# EAGLE design project (EAGLE 6.4)
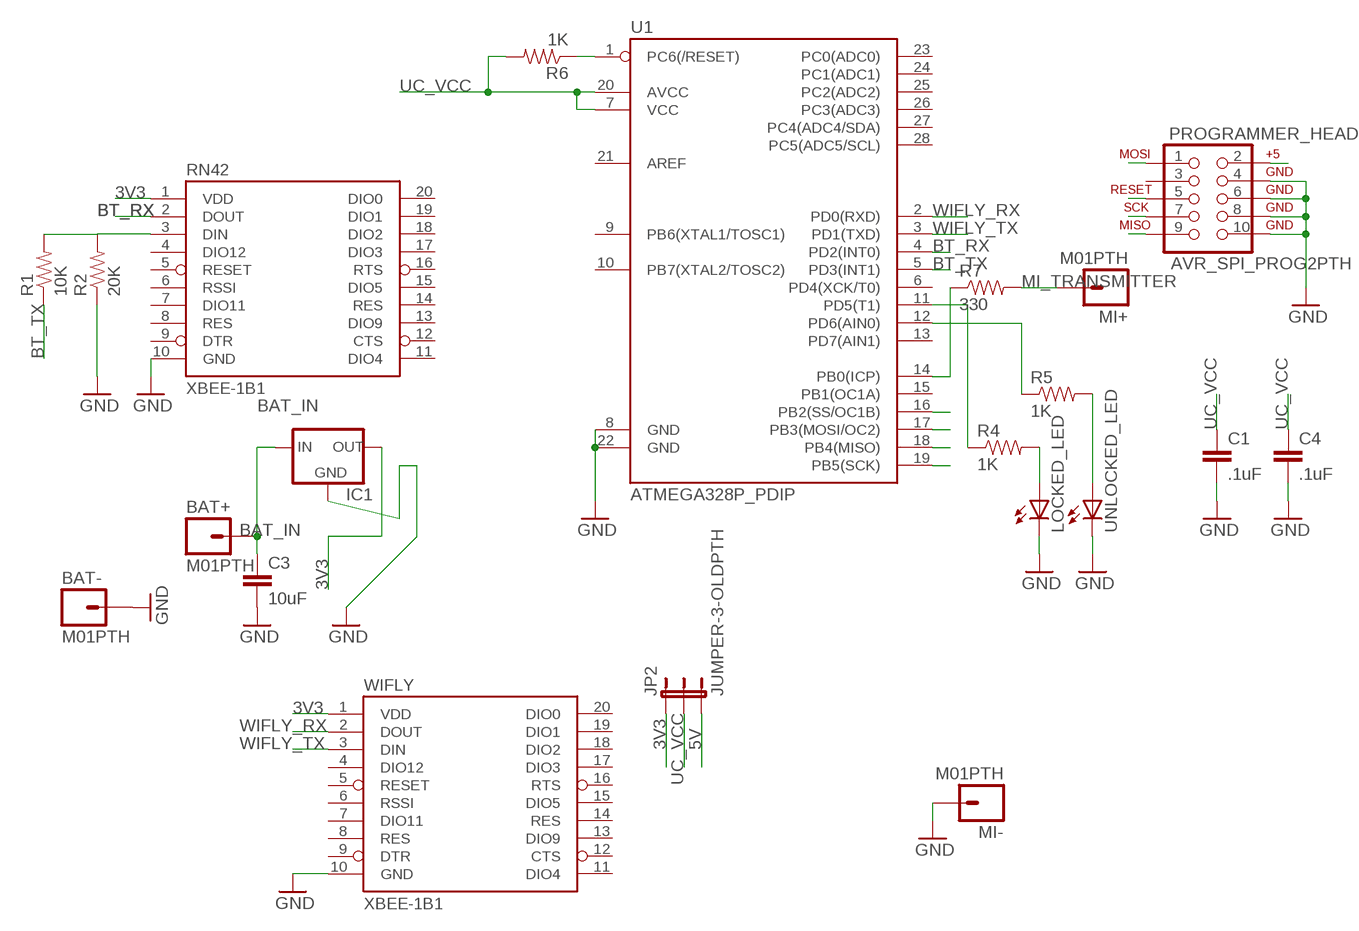
[diagram p0: schematic, sheet 1]

## Parts
BAT+  M01PTH  [1X01]
BAT-  M01PTH  [1X01]
C1  .1uF  CAPPTH  [CAP-PTH-SMALL]
C3  10uF  CAPPTH  [CAP-PTH-SMALL]
C4  .1uF  CAPPTH  [CAP-PTH-SMALL]
IC1  V_REG_78XXSIDE  [78XXL]
JP2  JUMPER-3-OLDPTH  [1X03]
LOCKED_LED  LED5MM  [LED5MM]
MI+  M01PTH  [1X01]
MI-  M01PTH  [1X01]
PROGRAMMER_HEADER  AVR_SPI_PROG2PTH  [AVR_ICSP]
R1  10K  RESISTORAXIAL-0.3  [AXIAL-0.3]
R2  20K  RESISTORAXIAL-0.3  [AXIAL-0.3]
R4  1K  RESISTORAXIAL-0.3  [AXIAL-0.3]
R5  1K  RESISTORAXIAL-0.3  [AXIAL-0.3]
R6  1K  RESISTORAXIAL-0.3  [AXIAL-0.3]
R7  330  RESISTORAXIAL-0.3  [AXIAL-0.3]
RN42  XBEE-1B1  [XBEE-1]
U1  ATMEGA328P_PDIP  [DIL28-3]
UNLOCKED_LED  LED5MM  [LED5MM]
WIFLY  XBEE-1B1  [XBEE-1]

## Nets
3V3: IC1.OUT JP2.1 RN42.1(VDD) WIFLY.1(VDD)
5V: JP2.3 PROGRAMMER_HEADER.2
BAT_IN: BAT+.1 C3.1 IC1.IN
BT_RX: RN42.2(DOUT) U1.4(PD2(INT0))
BT_TX: R1.P$1 U1.5(PD3(INT1))
GND: BAT-.1 C1.2 C3.2 C4.2 IC1.GND LOCKED_LED.K(C) MI-.1 PROGRAMMER_HEADER.4 PROGRAMMER_HEADER.6 PROGRAMMER_HEADER.8 PROGRAMMER_HEADER.10 R2.P$1 RN42.10(GND) U1.8(GND) U1.22(GND) UNLOCKED_LED.K(C) WIFLY.10(GND)
MI_TRANSMITTER: MI+.1 R7.P$2
MISO: PROGRAMMER_HEADER.9 U1.18(PB4(MISO))
MOSI: PROGRAMMER_HEADER.1 U1.17(PB3(MOSI/OC2))
N$1: R1.P$2 R2.P$2 RN42.3(DIN)
N$2: R5.P$1 U1.12(PD6(AIN0))
N$3: U1.16(PB2(SS/OC1B))
N$4: R4.P$1 U1.11(PD5(T1))
N$5: LOCKED_LED.A R4.P$2
N$6: R5.P$2 UNLOCKED_LED.A
N$7: R7.P$1 U1.14(PB0(ICP))
RESET: PROGRAMMER_HEADER.5 R6.P$1 U1.1(PC6(/RESET))
SCK: PROGRAMMER_HEADER.7 U1.19(PB5(SCK))
UC_VCC: C1.1 C4.1 JP2.2 R6.P$2 U1.7(VCC) U1.20(AVCC)
WIFLY_RX: U1.2(PD0(RXD)) WIFLY.2(DOUT)
WIFLY_TX: U1.3(PD1(TXD)) WIFLY.3(DIN)
Unconnected: PROGRAMMER_HEADER.3 RN42.4(DIO12) RN42.5(RESET) RN42.6(RSSI) RN42.7(DIO11) RN42.8(RES) RN42.9(DTR) RN42.11(DIO4) RN42.12(CTS) RN42.13(DIO9) RN42.14(RES) RN42.15(DIO5) RN42.16(RTS) RN42.17(DIO3) RN42.18(DIO2) RN42.19(DIO1) RN42.20(DIO0) U1.6(PD4(XCK/T0)) U1.9(PB6(XTAL1/TOSC1)) U1.10(PB7(XTAL2/TOSC2)) U1.13(PD7(AIN1)) U1.15(PB1(OC1A)) U1.21(AREF) U1.23(PC0(ADC0)) U1.24(PC1(ADC1)) U1.25(PC2(ADC2)) U1.26(PC3(ADC3)) U1.27(PC4(ADC4/SDA)) U1.28(PC5(ADC5/SCL)) WIFLY.4(DIO12) WIFLY.5(RESET) WIFLY.6(RSSI) WIFLY.7(DIO11) WIFLY.8(RES) WIFLY.9(DTR) WIFLY.11(DIO4) WIFLY.12(CTS) WIFLY.13(DIO9) WIFLY.14(RES) WIFLY.15(DIO5) WIFLY.16(RTS) WIFLY.17(DIO3) WIFLY.18(DIO2) WIFLY.19(DIO1) WIFLY.20(DIO0)

## Library data of the parts
BAT+ BAT- MI+ MI- = SparkFun-Connectors:M01: Header 1 Standard 1-pin 0.1" header. Use with straight break away headers (SKU : PRT-00116), right angle break away headers (PRT-00553), swiss pins (PRT-00743), machine pins (PRT-00117), and female headers (PRT-00115).
C1 C3 C4 = SparkFun-Capacitors:CAP: Capacitor Standard 0603 ceramic capacitor, and 0.1" leaded capacitor.
IC1 = SparkFun-PowerIC:V_REG_78XX: Voltage Regulator Standard 7805 5V regulator. IGO (Input Ground Output). Spark Fun Electronics SKU : COM-00107
JP2 = SparkFun-Passives:JUMPER-3-OLD
LOCKED_LED UNLOCKED_LED = SparkFun-LED:LED: LEDs Standard schematic elements and footprints for 5mm, 3mm, 1206, and 0603 sized LEDs. 5mm - Spark Fun Electronics SKU : COM-00529 (and others)
PROGRAMMER_HEADER = SparkFun-Connectors:AVR_SPI_PROG2: AVR 10-pin ICSP Header This is the standard AVR In Circuit Serial Programming header. Minimal, but includes pin one indicator. Works with standard Olimex programmers. Also look for the 6-pin reduced version. Spark Fun Electronics SKU: PRT-00778
R1 R2 R4-R7 = SparkFun-Passives:RESISTOR: Resistor Basic schematic elements and footprints for 0603, 1206, and PTH resistors.
RN42 WIFLY = SparkFun-RF:XBEE-1: Xbee module footprints SMT header is CONN-09042.
U1 = SparkFun-DigitalIC:ATMEGA328P_PDIP: uC used in the Arduino 32kb flash, 1k EEPROM, 2k SRAM This is the through-hole version of this chip.

## Board
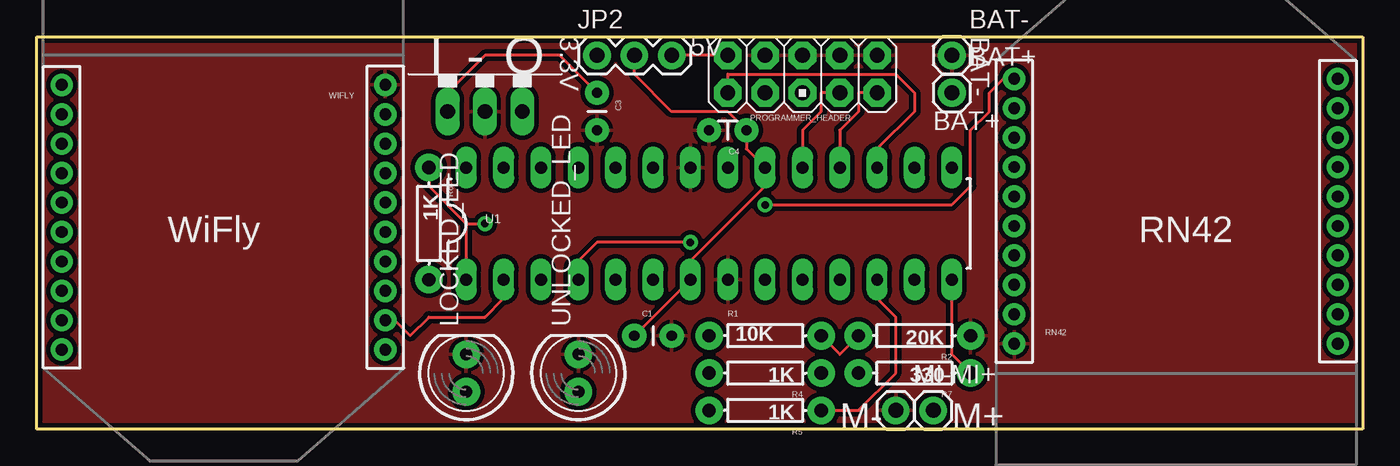
[diagram p1: board, top side]
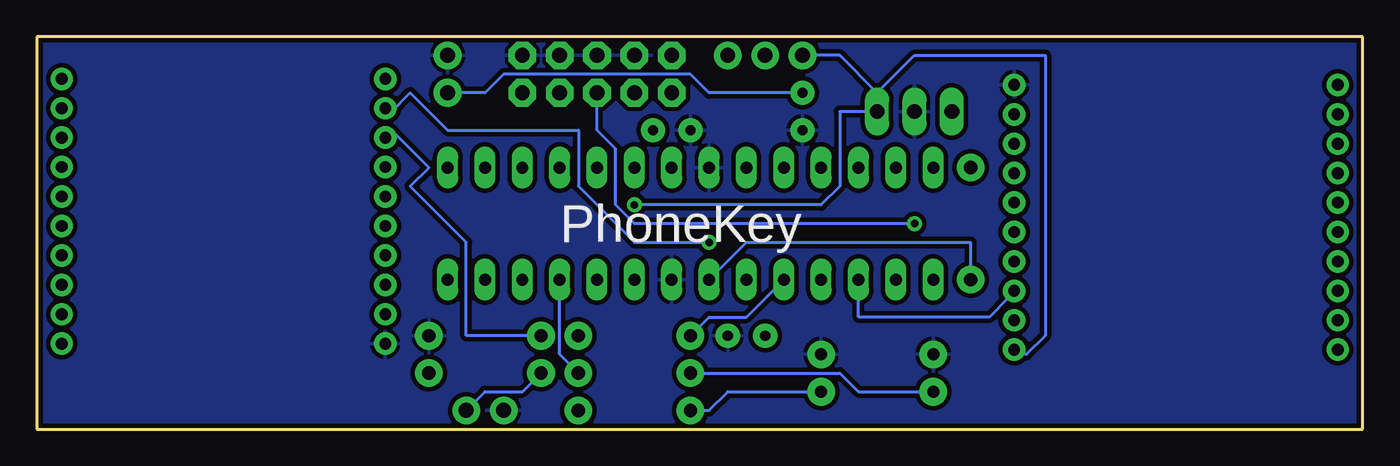
[diagram p2: board, bottom side, seen from below]

Size 90.17 x 26.67 mm. Coordinates in mm from the lower left corner, seen from the top.
Outline: 90.17,26.67 90.17,0 0,0 0,26.67 90.17,26.67
Copper layers (1*16): Top 0.035mm / dielectric 1.5mm / Bottom 0.035mm
Design rules "SparkFun": minimum track width 8mil, minimum drill 20mil, track to track 8mil, track to pad 8mil, pad to pad 8mil, via to via 8mil, smd to smd 8mil, copper to edge 8mil, drill to drill 8mil, minimum pad ring 12mil, minimum via ring 10mil, stop-mask expansion 4mil, vias tented up to drill 20mil, thermal gap 10mil

### Footprints (pad centres in the part's own frame; a part is rotated, then mirrored left to right if it is on the bottom)
1X01 = drill 1.016 pad 1.88: 1 0,0
CAP-PTH-SMALL = drill 0.7 pad 1.651: 1 0,0; 2 2.54,0
78XXL = drill 1.016 long: GND 0,-3.81; IN -2.54,-3.81; OUT 2.54,-3.81
1X03 = drill 1.016 pad 1.88: 1 0,0; 2 2.54,0; 3 5.08,0
LED5MM = drill 0.813 pad 1.88: A -1.27,0; K 1.27,0
AVR_ICSP = drill 1.016 pad 1.88 octagon: 1 -1.27,5.08; 2 1.27,5.08; 3 -1.27,2.54; 4 1.27,2.54; 5 -1.27,0; 6 1.27,0; 7 -1.27,-2.54; 8 1.27,-2.54; 9 -1.27,-5.08; 10 1.27,-5.08
AXIAL-0.3 = drill 0.9 pad 1.88: P$1 -3.81,0; P$2 3.81,0
XBEE-1 = drill 0.8 pad 1.524: 1 -11,20; 2 -11,18; 3 -11,16; 4 -11,14; 5 -11,12; 6 -11,10; 7 -11,8; 8 -11,6; 9 -11,4; 10 -11,2; 11 11,2; 12 11,4; 13 11,6; 14 11,8; 15 11,10; 16 11,12; 17 11,14; 18 11,16; 19 11,18; 20 11,20
DIL28-3 = drill 0.813 long: 1 -16.51,-3.81; 2 -13.97,-3.81; 3 -11.43,-3.81; 4 -8.89,-3.81; 5 -6.35,-3.81; 6 -3.81,-3.81; 7 -1.27,-3.81; 8 1.27,-3.81; 9 3.81,-3.81; 10 6.35,-3.81; 11 8.89,-3.81; 12 11.43,-3.81; 13 13.97,-3.81; 14 16.51,-3.81; 15 16.51,3.81; 16 13.97,3.81; 17 11.43,3.81; 18 8.89,3.81; 19 6.35,3.81; 20 3.81,3.81; 21 1.27,3.81; 22 -1.27,3.81; 23 -3.81,3.81; 24 -6.35,3.81; 25 -8.89,3.81; 26 -11.43,3.81; 27 -13.97,3.81; 28 -16.51,3.81

### Placement (x,y rotation side)
BAT+  62.23,22.86 0 top
BAT-  62.23,25.4 0 top
C1  40.64,6.35 0 top
C3  38.1,22.86 270 top
C4  48.26,20.32 180 top
IC1  30.48,25.4 0 top
JP2  38.1,25.4 0 top
LOCKED_LED  29.21,3.81 90 top
MI+  60.96,1.27 0 top
MI-  58.42,1.27 0 top
PROGRAMMER_HEADER  52.07,24.13 90 top
R1  49.53,6.35 0 top
R2  59.69,6.35 180 top
R4  49.53,3.81 180 top
R5  49.53,1.27 180 top
R6  26.67,13.97 270 top
R7  59.69,3.81 180 top
RN42  77.47,3.81 0 top
U1  45.72,13.97 0 top
UNLOCKED_LED  36.83,3.81 90 top
WIFLY  12.7,25.4 180 top

### Tracks (layer width: path | path; a pad name or v marks a point on that pad's centre or on a via)
3V3  (via drill 0.51)
  Top 0.203: v49.53,15.24 62.23,15.24 63.5,16.51 63.5,20.32 64.77,21.59 64.77,22.86 66.04,24.13 RN42.1
  Bottom 0.203: 33.02,22.86 30.48,25.4 21.59,25.4 21.59,6.35 22.86,5.08 24.13,5.08 WIFLY.1 | v49.53,15.24 36.83,15.24 35.56,16.51 35.56,21.59 IC1.OUT 33.02,22.86 | JP2.1 35.56,25.4 33.02,22.86
5V
  Top 0.203: PROGRAMMER_HEADER.2 JP2.3
BAT_IN
  Top 0.203: IC1.IN 27.94,22.86 30.48,25.4 35.56,25.4 C3.1
  Bottom 0.203: BAT+.1 59.69,22.86 58.42,24.13 45.72,24.13 44.45,22.86 C3.1
BT_RX  (via drill 0.51)
  Top 0.203: U1.4 36.83,11.43 38.1,12.7 v44.45,12.7
  Bottom 0.203: v44.45,12.7 49.53,12.7 53.34,16.51 53.34,20.32 62.23,20.32 64.77,22.86 66.04,21.59 RN42.2
BT_TX
  Bottom 0.203: U1.5 41.91,7.62 44.45,7.62 R1.P$1
GND
  pour Top (isolate 0.305): 0,0 0,26.67 90.17,26.67 90.17,0
  pour Bottom (isolate 0.305): 0,0 0,26.67 90.17,26.67 90.17,0
MI_TRANSMITTER
  Bottom 0.203: R7.P$2 57.15,2.54 59.69,2.54 MI+.1
MISO
  Top 0.203: U1.18 54.61,20.32 55.88,21.59 55.88,22.86 PROGRAMMER_HEADER.9
MOSI
  Top 0.203: U1.17 57.15,19.05 59.69,21.59 59.69,22.86 58.42,24.13 46.99,24.13 PROGRAMMER_HEADER.1
N$1
  Top 0.203: R1.P$2 54.61,5.08 R2.P$2
  Bottom 0.203: R2.P$2 60.96,6.35 60.96,12.7 64.77,16.51 63.5,17.78 66.04,20.32 RN42.3
N$2
  Top 0.203: U1.12 57.15,8.89 58.42,7.62 58.42,3.81 55.88,1.27 R5.P$1
N$4
  Bottom 0.203: U1.11 54.61,5.08 R4.P$1
N$5
  Bottom 0.203: LOCKED_LED.A 34.29,2.54 35.56,3.81 R4.P$2
N$6
  Bottom 0.203: UNLOCKED_LED.A 43.18,2.54 44.45,1.27 R5.P$2
N$7
  Top 0.203: U1.14 62.23,5.08 R7.P$1
RESET  (via drill 0.51)
  Top 0.203: 29.21,13.97 U1.1 | 29.21,13.97 26.67,16.51 R6.P$1 | 29.21,13.97 v30.48,13.97
  Bottom 0.203: PROGRAMMER_HEADER.5 52.07,20.32 50.8,19.05 50.8,15.24 49.53,13.97 v30.48,13.97
SCK
  Top 0.203: U1.19 52.07,20.32 53.34,21.59 53.34,22.86 PROGRAMMER_HEADER.7
UC_VCC
  Top 0.203: JP2.2 40.64,24.13 43.18,21.59 46.99,21.59 C4.1 48.26,19.05 U1.20 49.53,16.51 44.45,11.43 U1.7 C1.1
  Bottom 0.203: R6.P$2 26.67,12.7 41.91,12.7 U1.7
WIFLY_RX
  Top 0.203: U1.2 31.75,8.89 30.48,7.62 26.67,7.62 25.4,6.35 24.13,7.62 WIFLY.2
WIFLY_TX
  Bottom 0.203: U1.3 34.29,7.62 25.4,7.62 24.13,8.89 WIFLY.3

### Text on the board
tPlace: 3.3V | BAT- | 5V | I | - | O | BAT+ | WiFly | RN42 | M- | M+
bPlace: PhoneKey